# Altium project Smart wrist Band.PrjPcb
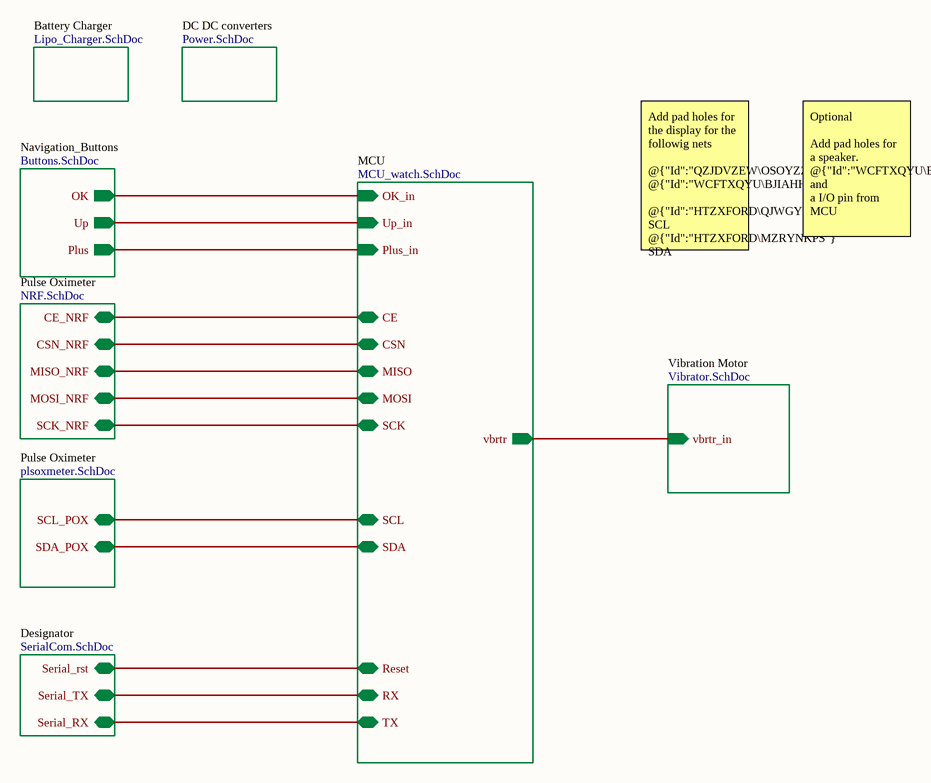
[diagram p0: Wrist watch main.SchDoc]
9 sheets, 85 parts. Net scope: hierarchical (ports join the sheet entries above them; power ports are global).
Board file: wrist_band_v1.0.PcbDoc
Sheets:
  Wrist watch main.SchDoc
    MCU = MCU_watch.SchDoc
    Pulse Oximeter = plsoxmeter.SchDoc
    Battery Charger = Lipo_Charger.SchDoc
    Vibration Motor = Vibrator.SchDoc
    Navigation_Buttons = Buttons.SchDoc
    DC DC converters = Power.SchDoc
    Pulse Oximeter = NRF.SchDoc
    Designator = SerialCom.SchDoc

## Sheet Wrist watch main.SchDoc: Wrist watch main
size A4; Subtitle: Subtitle; Project: Stearsafe; VersionRevision: VersionRevision; TotalSheet: TotalSheet; Author: Sajitha Madugalle; Revision: 1; SheetNumber: 1; SheetTotal: 9

### Sub-sheets
Battery Charger = Lipo_Charger.SchDoc: no entries
DC DC converters = Power.SchDoc: no entries
Designator = SerialCom.SchDoc: Serial_rst (bidir), Serial_TX (bidir), Serial_RX (bidir)
MCU = MCU_watch.SchDoc: SDA (bidir), SCL (bidir), OK_in (in), Up_in (in), Plus_in (in), vbrtr (out), CE (bidir), CSN (bidir), MISO (bidir), MOSI (bidir), SCK (bidir), Reset (bidir), RX (bidir), TX (bidir)
Navigation_Buttons = Buttons.SchDoc: OK (out), Up (out), Plus (out)
Pulse Oximeter = plsoxmeter.SchDoc: SCL_POX (bidir), SDA_POX (bidir)
Pulse Oximeter = NRF.SchDoc: CE_NRF (bidir), CSN_NRF (bidir), MISO_NRF (bidir), MOSI_NRF (bidir), SCK_NRF (bidir)
Vibration Motor = Vibrator.SchDoc: vbrtr_in (in)

### Nets
RST: sheet MCU/Reset, sheet Designator/Serial_rst
SW1: sheet MCU/Up_in, sheet Navigation_Buttons/Up
SW2: sheet MCU/OK_in, sheet Navigation_Buttons/OK
SW3: sheet MCU/Plus_in, sheet Navigation_Buttons/Plus
NetIC2_2: sheet MCU/SCL, sheet Pulse Oximeter/SCL_POX
NetIC2_3: sheet MCU/SDA, sheet Pulse Oximeter/SDA_POX
NetIC4_1: sheet MCU/CE, sheet Pulse Oximeter/CE_NRF
NetIC4_2: sheet MCU/CSN, sheet Pulse Oximeter/CSN_NRF
NetIC4_3: sheet MCU/SCK, sheet Pulse Oximeter/SCK_NRF
NetIC4_4: sheet MCU/MOSI, sheet Pulse Oximeter/MOSI_NRF
NetIC4_5: sheet MCU/MISO, sheet Pulse Oximeter/MISO_NRF
NetR10_1: sheet MCU/vbrtr, sheet Vibration Motor/vbrtr_in
NetR20_1: sheet MCU/TX, sheet Designator/Serial_RX
NetR21_1: sheet MCU/RX, sheet Designator/Serial_TX

### Notes on the sheet
- Add pad holes for the display for the followig nets
  @{"Id":"QZJDVZEW\OSOYZZOG"} @{"Id":"WCFTXQYU\BJIAHHOM"}
  @{"Id":"HTZXFORD\QJWGYBCR"} SCL
  @{"Id":"HTZXFORD\MZRYNKPS"} SDA
- Optional
  Add pad holes for a speaker. @{"Id":"WCFTXQYU\BJIAHHOM"} and
  a I/O pin from MCU
- Title:
- Size:
- Document Number :
- Revision
- Drawn by:
- Checked by:
- Date:
- A4
- Time:
- Aprooved by:
- Sheet:
- of
- File:

## Sheet MCU_watch.SchDoc: MCU_Watch
size A4; Author: Sajitha Madugalle; Revision: 1; SheetNumber: 5; SheetTotal: 8
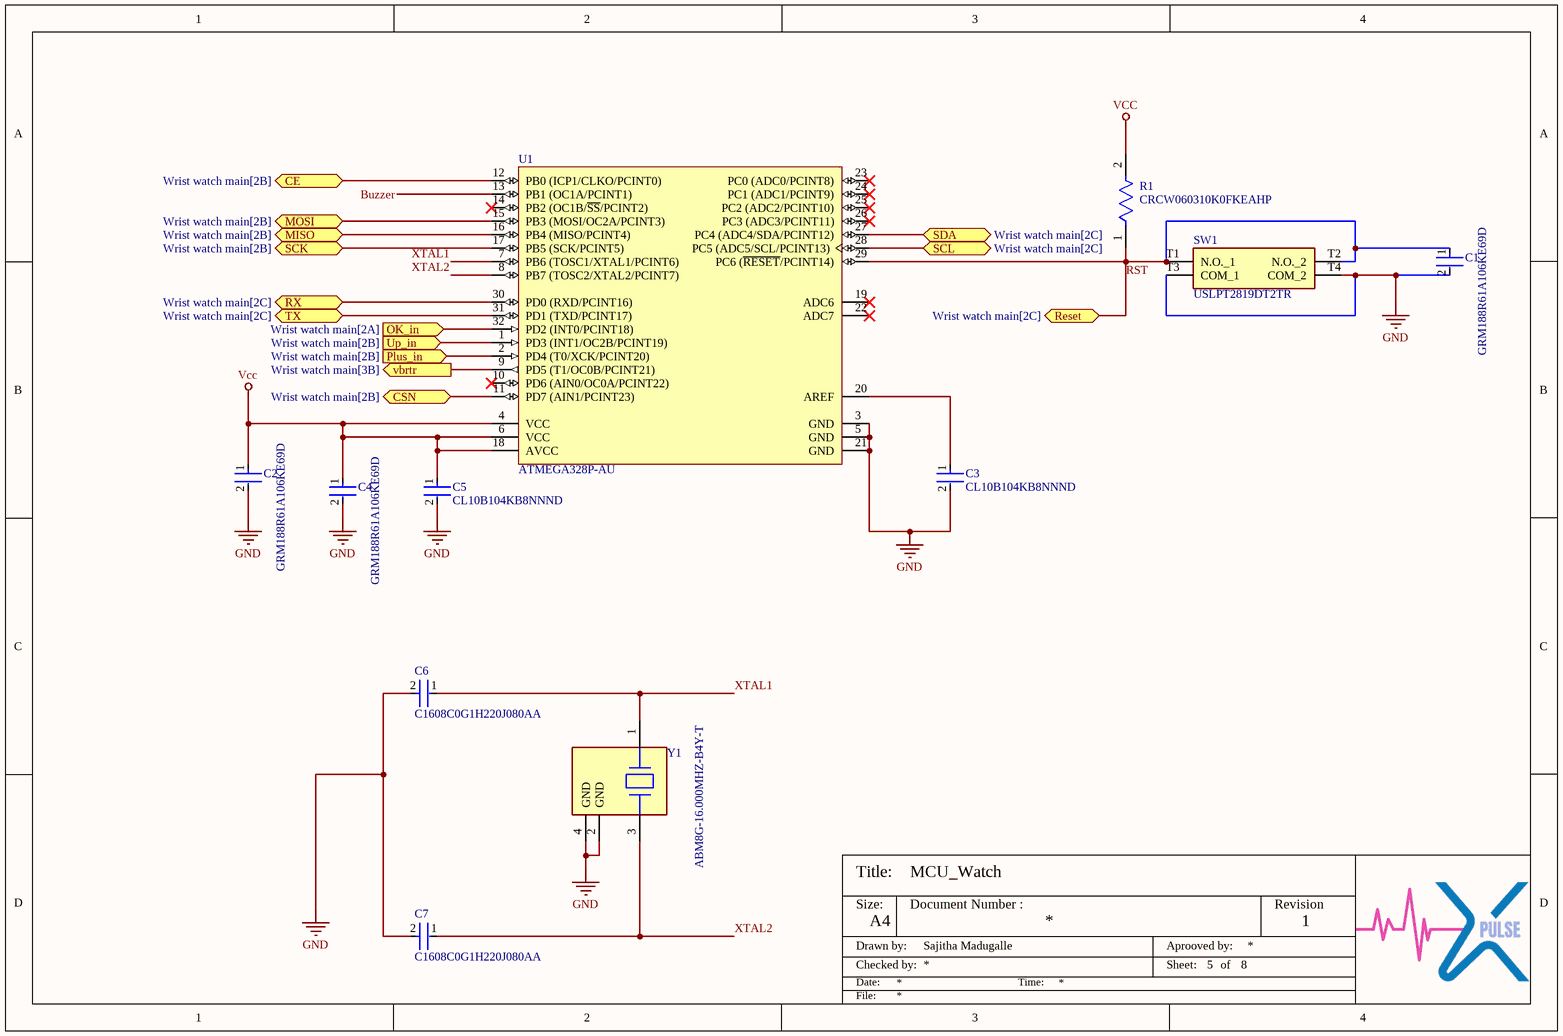
[diagram p1: MCU_watch.SchDoc]

### Parts
C1  GRM188R61A106KE69D  [FP-GRM18-0_15-MFG]
C2  GRM188R61A106KE69D  [FP-GRM18-0_15-MFG]
C3  CL10B104KB8NNND  [FP-CL10-IPC_A]
C4  GRM188R61A106KE69D  [FP-GRM18-0_15-MFG]
C5  CL10B104KB8NNND  [FP-CL10-IPC_A]
C6  C1608C0G1H220J080AA  [FP-C1608-080-0_1-IPC_B]
C7  C1608C0G1H220J080AA  [FP-C1608-080-0_1-IPC_B]
R1  CRCW060310K0FKEAHP  [FP-CRCW0603-HPe3-MFG]
SW1  USLPT2819DT2TR  [USLPT2819DT2TR]
U1  ATMEGA328P-AU  [ATML-32A_M]
Y1  ABM8G-16.000MHZ-B4Y-T  [FP-ABM8G-MFG]

### Ports
CE (bidir, see Wrist watch main[2B]), CSN (bidir, see Wrist watch main[2B]), MISO (bidir, see Wrist watch main[2B]), MOSI (bidir, see Wrist watch main[2B]), OK_in (in, see Wrist watch main[2A]), Plus_in (in, see Wrist watch main[2B]), Reset (bidir, see Wrist watch main[2C]), RX (bidir, see Wrist watch main[2C]), SCK (bidir, see Wrist watch main[2B]), SCL (bidir, see Wrist watch main[2C]), SDA (bidir, see Wrist watch main[2C]), TX (bidir, see Wrist watch main[2C]), Up_in (in, see Wrist watch main[2B]), vbrtr (out, see Wrist watch main[3B])

### Nets
GND: C1.2 C2.2 C3.2 C4.2 C5.2 C6.2 C7.2 SW1.T3(COM_1) SW1.T4(COM_2) U1.3(GND) U1.5(GND) U1.21(GND) Y1.2(GND) Y1.4(GND)
Vcc: C2.1 C4.1 C5.1 R1.2 U1.4(VCC) U1.6(VCC) U1.18(AVCC)
Buzzer: U1.13(PB1_(OC1A/PCINT1))
RST: C1.1 R1.1 SW1.T1(N.O._1) SW1.T2(N.O._2) U1.29(PC6_(~{RESET}/PCINT14)) ; port Reset
SW1: U1.1(PD3_(INT1/OC2B/PCINT19)) ; port Up_in
SW2: U1.32(PD2_(INT0/PCINT18)) ; port OK_in
SW3: U1.2(PD4_(T0/XCK/PCINT20)) ; port Plus_in
XTAL1: C6.1 U1.7(PB6_(TOSC1/XTAL1/PCINT6)) Y1.1
XTAL2: C7.1 U1.8(PB7_(TOSC2/XTAL2/PCINT7)) Y1.3
NetC3_1: C3.1 U1.20(AREF)
NetIC2_2: U1.28(PC5_(ADC5/SCL/PCINT13)) ; port SCL
NetIC2_3: U1.27(PC4_(ADC4/SDA/PCINT12)) ; port SDA
NetIC4_1: U1.12(PB0_(ICP1/CLKO/PCINT0)) ; port CE
NetIC4_2: U1.11(PD7_(AIN1/PCINT23)) ; port CSN
NetIC4_3: U1.17(PB5_(SCK/PCINT5)) ; port SCK
NetIC4_4: U1.15(PB3_(MOSI/OC2A/PCINT3)) ; port MOSI
NetIC4_5: U1.16(PB4_(MISO/PCINT4)) ; port MISO
NetR10_1: U1.9(PD5_(T1/OC0B/PCINT21)) ; port vbrtr
NetR20_1: U1.31(PD1_(TXD/PCINT17)) ; port TX
NetR21_1: U1.30(PD0_(RXD/PCINT16)) ; port RX

Not connected (* = marked no-connect by the designer): U1 10(PD6_(AIN0/OC0A/PCINT22))* 14(PB2_(OC1B/~{SS}/PCINT2))* 19(ADC6)* 22(ADC7)* 23(PC0_(ADC0/PCINT8))* 24(PC1_(ADC1/PCINT9))* 25(PC2_(ADC2/PCINT10))* 26(PC3_(ADC3/PCINT11))*

### Notes on the sheet
- Title:
- Size:
- Document Number :
- Revision
- Drawn by:
- Checked by:
- Date:
- A4
- Time:
- Aprooved by:
- Sheet:
- of
- File:

### Library data of the parts
C1 C2 C4 = CMP-2000-05448-2: CAP CER 10UF 10V X5R 0603; Manufacturer: Murata; Temperature Coefficient: 15%; Material: Ceramic; Tolerance: 10%; Device Class L1: Passive Components; ComponentLink2Description: Datasheet; Height: 0.95mm; Package: GRM18-0.15; Octopart: https://octopart.com/grm188r61a106ke69d-murata-22851381; Manufacturer Part Number: GRM188R61A106KE69D; Value: 10uF; Digikey Description: CAP CER 10UF 10V X5R 0603; Temperature Range High: +85°C; Temperature Range Low: -55°C; Temperature Characteristic: X5R; Capacitance: 10uF; RoHS: TRUE; Device Class L2: Capacitors; ComponentLink2URL: https://search.murata.co.jp/Ceramy/image/img/A01X/G101/ENG/GRM188R61A106KE69-01A.pdf; Device Class L3: Ceramic Capacitors; Lead Free: Yes; Mouser Description: Multilayer Ceramic Capacitors MLCC - SMD/SMT 0603 10uF 10volts X5R + - 10%; Category: Cap; Voltage Rating: 10V; Temperature: -55°C to +85°C; Automotive: No
C3 C5 = CMP-13271-000587-1: Cap Ceramic 100nF 50V X7R ±10% Pad SMD 0603 +125°C T/R; Case/Package: 0603; Depth: 0.8mm; Max Operating Temperature: 125°C; Lead Free: Lead Free; Material: Ceramic; Voltage Rating: 50V; Min Operating Temperature: -55°C; Voltage Rating (DC): 50V; Dielectric: X7R; Height: 0.8mm; Capacitance: 100nF; Thickness: 0.035inch; Radiation Hardening: No; Voltage: 50V; Packaging: Tape and Reel; Length: 1.6mm; Tolerance: 10%; Width: 0.031inch; Mount: Surface Mount; Package Quantity: 10000
C6 C7 = CMP-2000-06024-2: CAP CER 22PF 50V C0G 0603; Tolerance: 5%; Temperature Coefficient: 30ppm/°C; Dielectric Material: Ceramic; Packaging: Tape and Reel; Termination: SMD/SMT; Case Code (Imperial): 0603; Height: 0.8mm; Capacitance: 22pF; Voltage: 50V; RoHS Compliant: Yes; Voltage Rating: 50V; Depth: 0.8mm; Case Code (Metric): 1608; Voltage Rating (DC): 50V; Construction: Flat; Max Operating Temperature: 125°C; Radiation Hardening: No; Lead Free: Lead Free; Number of Pins: 2; Case/Package: 0603; Thickness: 0.037inch; Min Operating Temperature: -55°C; Width: 0.031inch; Mount: Surface Mount; Weight: 7.1E-05oz; Series: C; Dielectric: C0G; Package Quantity: 1; Length: 1.6mm
R1 = CMP-2000-03835-2: RES SMD 10K OHM 1% 1/3W 0603; Resistance: 10kR; Voltage Rating (DC): 75V; Max Power Dissipation: 250mW; Temperature Coefficient: 100ppm/°C; Case Code (Metric): 1608; Features: Automotive AEC-Q200; Termination: SMD/SMT; Number of Terminations: 2; Case Code (Imperial): 0603; Tolerance: 1%; Depth: 0.85mm; Package Quantity: 10; Length: 1.6mm; Packaging: Tape and Reel; Contact Plating: Tin; Radiation Hardening: No; Case/Package: 0603; Composition: Thick Film; Voltage Rating: 75V; Weight: 7.1E-05oz; Max Operating Temperature: 155°C; Lead Free: Lead Free; Width: 0.033inch; Power Rating: 250mW; Min Operating Temperature: -55°C; Military Standard: Not; Height: 0.45mm
SW1 = USLPT2819DT2TR: Switch; Manufacturer_Name: TE Connectivity; Datasheet Link: https://www.te.com/commerce/DocumentDelivery/DDEController?Action=srchrtrv&DocNm=2337225-1&DocType=Data%20Sheet&DocLang=English&PartCntxt=2337225-1&DocFormat=pdf; Height: 0.6mm; Manufacturer_Part_Number: USLPT2819DT2TR; Mouser Part Number: 506-USLPT2819DT2TR; Mouser Price/Stock: https://www.mouser.co.uk/ProductDetail/TE-Connectivity-PB/USLPT2819DT2TR?qs=qSfuJ%252Bfl%2Fd7zUoyEnK5Yzg%3D%3D; Arrow Part Number: USLPT2819DT2TR; Arrow Price/Stock: https://www.arrow.com/en/products/uslpt2819dt2tr/te-connectivity?region=nac
U1 = CMP-020-00003-3: 8-Bit Microcontroller with 32 KBytes In-System Programmable Flash, 23 I/Os, -40 to 85 degC, 32-Pin TQFP (32A), RoHS, Tray; Manufacturer: Atmel; PWM Channels: 6; Frequency: 20MHz; RAM Size: 2KB; ADC Channels: 8; Max Supply Voltage: 5.5V; Density: 32KB; USB Channels: 0; I/Os: 23; Min Supply Voltage: 1.8V; Interface: USART; Package Reference: 32A; Package Description: 32-Pin Thin Profile Plastic Quad Flat Package, Body 7 x 7 mm, Pitch 0.8 mm; Max Operating Temperature: 85°C; Mounting Technology: SM; Datasheet URL: http://www.atmel.com/images/Atmel-8271-8-bit-AVR-Microcontroller-ATmega48A-48PA-88A-88PA-168A-168PA-328-328P_datasheet_Complete.pdf; Pins: 32; Packaging: Tray; RoHS Compliant: True; Max Clock Frequency: 20MHz; Ethernet Channels: 0; Clock Frequency: 20MHz; Case/Package: TQFP; Manufacturer URL: http://www.atmel.com/; Datasheet Version: Rev. 8271J, 11/2015; Package Quantity: 250; Min Operating Temperature: -40°C
Y1 = CMP-27762-015167-1: Crystal 16MHz ±30ppm (Tol) ±30ppm (Stability) 10pF FUND 80Ω 4-Pin SMD T/R; ESR (Equivalent Series Resistance): 80R; Package Quantity: 1000; Frequency: 16MHz; Length: 3.2mm; Tolerance: 30ppm; Frequency Stability: 30ppm; Depth: 2.5mm; Termination: SMD/SMT; Number of Pins: 4; Max Operating Temperature: 70°C; Min Operating Temperature: -20°C; Mount: Surface Mount; Lead Free: Lead Free; Frequency Tolerance: 30ppm; Width: 2.5mm; Series: ABM8G; Load Capacitance: 10pF; Operating Frequency: 16 MHz; Case/Package: CSMD; Height: 1mm; Packaging: Tape and Reel

## Sheet plsoxmeter.SchDoc: Pulse oximeter
size A4; Revision: 1; SheetNumber: 5; SheetTotal: 9
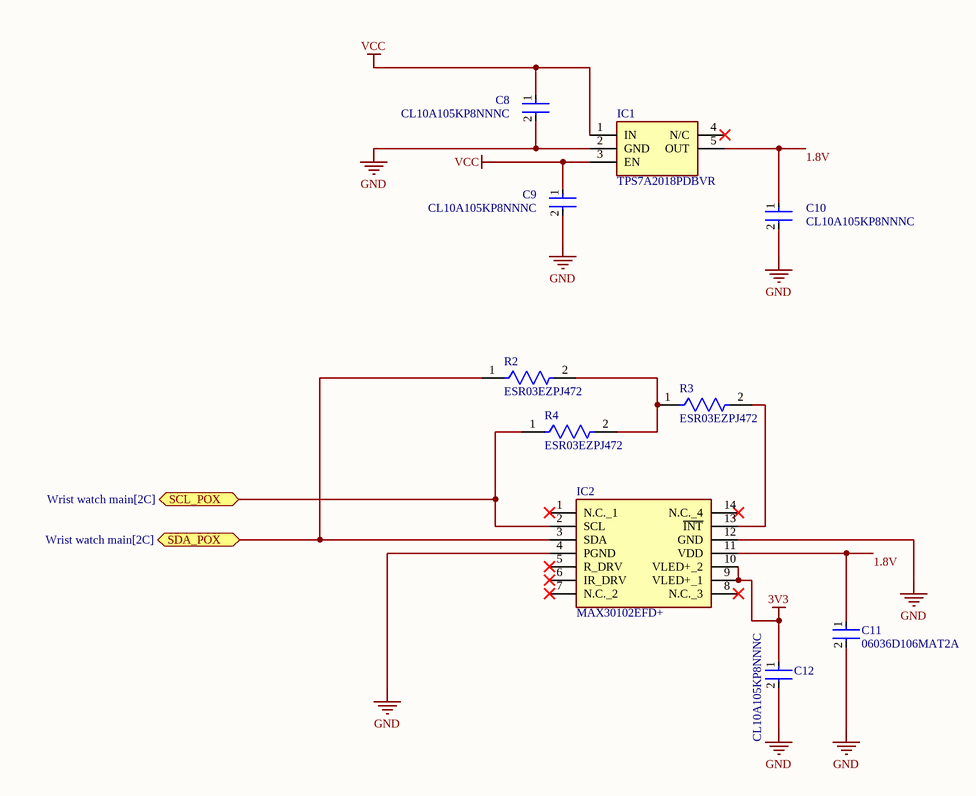
[diagram p2: plsoxmeter.SchDoc]

### Parts
C8  CL10A105KP8NNNC  [FP-CL10-IPC_C]
C9  CL10A105KP8NNNC  [FP-CL10-IPC_C]
C10  CL10A105KP8NNNC  [FP-CL10-IPC_C]
C11  06036D106MAT2A  [FP-0603-L_1_6_0_15-W_0_81-IPC_B]
C12  CL10A105KP8NNNC  [FP-CL10-IPC_C]
IC1  TPS7A2018PDBVR  [SOT95P280X145-5N]
IC2  MAX30102EFD+  [14-LEAD-OESIP]
R2  ESR03EZPJ472  [FP-ESR03-IPC_A]
R3  ESR03EZPJ472  [FP-ESR03-IPC_A]
R4  ESR03EZPJ472  [FP-ESR03-IPC_A]

### Ports
SCL_POX (bidir, see Wrist watch main[2C]), SDA_POX (bidir, see Wrist watch main[2C])

### Nets
3V3: C12.1 IC2.9(VLED+_1) IC2.10(VLED+_2)
GND: C8.2 C9.2 C10.2 C11.2 C12.2 IC1.2(GND) IC2.4(PGND) IC2.12(GND)
Vcc: C8.1 C9.1 IC1.1(IN) IC1.3(EN)
1.8V: C10.1 C11.1 IC1.5(OUT) IC2.11(VDD)
NetIC2_2: IC2.2(SCL) R4.1 ; port SCL_POX
NetIC2_3: IC2.3(SDA) R2.1 ; port SDA_POX
NetIC2_13: IC2.13(~{INT}) R3.2
NetR2_2: R2.2 R3.1 R4.2

Not connected (* = marked no-connect by the designer): IC1 4(N/C)*; IC2 1(N.C._1)* 5(R_DRV)* 6(IR_DRV)* 7(N.C._2)* 8(N.C._3)* 14(N.C._4)*

### Notes on the sheet
- Title:
- Size:
- Document Number :
- Revision
- Drawn by:
- Checked by:
- Date:
- A4
- Time:
- Aprooved by:
- Sheet:
- of
- File:
- URL:

### Library data of the parts
C8-C10 C12 = CMP-13271-003399-1: Cap Ceramic 1uF 10V X5R ±10% Pad SMD 0603 +85°C T/R; Min Operating Temperature: -55°C; Max Operating Temperature: 85°C; Dielectric: X5R; Contact Plating: Tin; Height: 0.8mm; Voltage: 10V; Packaging: Tape and Reel; Voltage Rating: 10V; Capacitance: 1uF; Package Quantity: 1; Width: 0.031inch; Length: 1.6mm; Depth: 0.8mm; Case/Package: 0603; Case Code (Imperial): 0603; Thickness: 0.035inch; Radiation Hardening: No; Tolerance: 10%; Case Code (Metric): 1608; Mount: Surface Mount
C11 = CMP-2006-04476-2: General Purpose Ceramic Capacitor, 0603, 10uF, 20%, X5R, 15%, 6.3V; RoHS Compliant: Yes; Case Code (Imperial): 0603; Construction: Flat; Thickness: 0.035inch; Height: 0.9mm; Number of Pins: 2; Max Operating Temperature: 85°C; Capacitance: 10uF; Length: 1.6mm; REACH SVHC: No SVHC; Width: 0.032inch; Voltage Rating (DC): 6.3V; Termination: SMD/SMT; Contact Plating: Tin; Min Operating Temperature: -55°C; Depth: 0.81mm; Packaging: Tape and Reel; Case Code (Metric): 1608; Voltage Rating: 6.3V; Lead Free: Lead Free; Mount: Surface Mount; Radiation Hardening: No; Series: -; Dielectric Material: Ceramic; Package Quantity: 1; Case/Package: 0603; Tolerance: 20%; Dielectric: X5R; Voltage: 6.3V
IC1 = TPS7A2018PDBVR: Integrated Circuit; Manufacturer_Name: Texas Instruments; Datasheet Link: https://datasheet.datasheetarchive.com/originals/distributors/Datasheets_SAMA/e65d9d311cedf91014769949f3101225.pdf; Height: 1.45mm; Manufacturer_Part_Number: TPS7A2018PDBVR; Mouser Part Number: 595-TPS7A2018PDBVR; Mouser Price/Stock: https://www.mouser.co.uk/ProductDetail/Texas-Instruments/TPS7A2018PDBVR?qs=hd1VzrDQEGheW9qdrIVGew%3D%3D; Arrow Part Number: TPS7A2018PDBVR; Arrow Price/Stock: https://www.arrow.com/en/products/tps7a2018pdbvr/texas-instruments?region=nac
IC2 = MAX30102EFD+: Integrated Circuit; Manufacturer_Name: Analog Devices; Datasheet Link: https://datasheets.maximintegrated.com/en/ds/MAX30102.pdf; Manufacturer_Part_Number: MAX30102EFD+; Mouser Part Number: 700-MAX30102EFD+; Mouser Price/Stock: https://www.mouser.co.uk/ProductDetail/Analog-Devices-Maxim-Integrated/MAX30102EFD%2b?qs=nVS1qgv%252BQrk9UYEvS27V%2Fg%3D%3D
R2-R4 = CMP-08839-007853-1: 4.7kΩ ±5% 0.25W 0603 Anti-Surge Chip Resistor AEC-Q200; Max Power Dissipation: 250mW; Resistance: 4.7kR; Temperature Coefficient: 200ppm/°C; Packaging: Tape and Reel; Series: ESR; Height: 0.022inch; Case Code (Imperial): 0603; Tolerance: 5%; RoHS Compliant: Yes; Case/Package: 0603; Min Operating Temperature: -55°C; Resistor Type: Thick Film; Package Quantity: 5000; Features: Automotive AEC-Q200; Width: 0.031inch; Length: 0.063inch; Max Operating Temperature: 155°C; Number of Terminations: 2

## Sheet Lipo_Charger.SchDoc: USB_Charger
size A4; Author: Sajitha Madugalle; Revision: 1; SheetNumber: 3; SheetTotal: 9
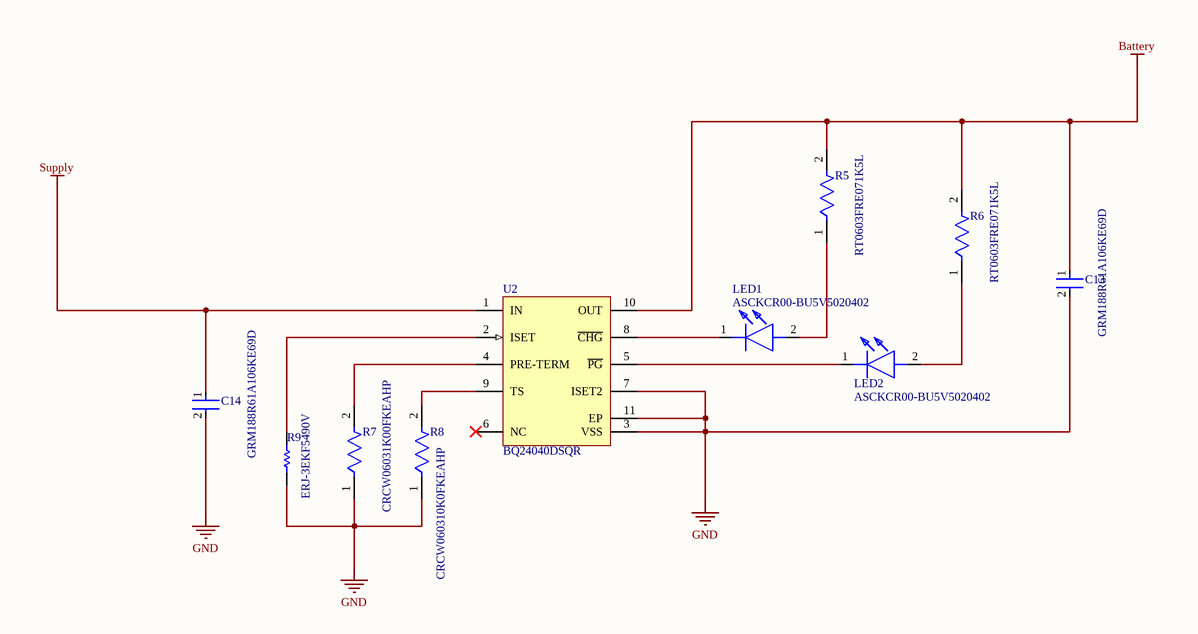
[diagram p3: Lipo_Charger.SchDoc]

### Parts
C13  GRM188R61A106KE69D  [FP-GRM18-0_15-MFG]
C14  GRM188R61A106KE69D  [FP-GRM18-0_15-MFG]
LED1  ASCKCR00-BU5V5020402  [ASCKCR00BU5V5020402]
LED2  ASCKCR00-BU5V5020402  [ASCKCR00BU5V5020402]
R5  RT0603FRE071K5L  [FP-RT0603-MFG]
R6  RT0603FRE071K5L  [FP-RT0603-MFG]
R7  CRCW06031K00FKEAHP  [FP-CRCW0603-HPe3-MFG]
R8  CRCW060310K0FKEAHP  [FP-CRCW0603-HPe3-MFG]
R9  ERJ-3EKF5490V  [RESC1608X55X30ML15T15]
U2  BQ24040DSQR  [DSQ0010A_V]

### Nets
Battery: C13.1 R5.2 R6.2 U2.10(OUT)
GND: C13.2 C14.2 R7.1 R8.1 R9.1 U2.3(VSS) U2.7(ISET2) U2.11(EP)
Supply: C14.1 U2.1(IN)
NetLED1_1: LED1.1(K) U2.8(~{CHG})
NetLED1_2: LED1.2(A) R5.1
NetLED2_1: LED2.1(K) U2.5(~{PG})
NetLED2_2: LED2.2(A) R6.1
NetR7_2: R7.2 U2.4(PRE-TERM)
NetR8_2: R8.2 U2.9(TS)
NetR9_2: R9.2 U2.2(ISET)

Not connected (* = marked no-connect by the designer): U2 6(NC)*

### Notes on the sheet
- Title:
- Size:
- Document Number :
- Revision
- Drawn by:
- Checked by:
- Date:
- A4
- Time:
- Aprooved by:
- Sheet:
- of
- File:

### Library data of the parts
C13 C14 = CMP-2000-05448-2: as C1 on sheet MCU_watch; Device Class L1: Passive Components; ComponentLink2Description: Datasheet; Height: 0.95mm; Package: GRM18-0.15; Octopart: https://octopart.com/grm188r61a106ke69d-murata-22851381; Manufacturer Part Number: GRM188R61A106KE69D; Value: 10uF; Digikey Description: CAP CER 10UF 10V X5R 0603; Temperature Range High: +85°C; Temperature Range Low: -55°C; Temperature Characteristic: X5R; Capacitance: 10uF; RoHS: TRUE; Device Class L2: Capacitors; ComponentLink2URL: https://search.murata.co.jp/Ceramy/image/img/A01X/G101/ENG/GRM188R61A106KE69-01A.pdf; Device Class L3: Ceramic Capacitors; Lead Free: Yes; Mouser Description: Multilayer Ceramic Capacitors MLCC - SMD/SMT 0603 10uF 10volts X5R + - 10%; Category: Cap; Voltage Rating: 10V; Temperature: -55°C to +85°C; Automotive: No
LED1 LED2 = ASCKCR00-BU5V5020402: LED; Manufacturer_Name: Avago Technologies; Datasheet Link: https://docs.broadcom.com/doc/ASCKCx00-xxxxx0x0x02-DS; Height: 0.75mm; Manufacturer_Part_Number: ASCKCR00-BU5V5020402; Mouser Part Number: 630-ASCKCR00BU5V5020; Mouser Price/Stock: https://www.mouser.co.uk/ProductDetail/Broadcom-Avago/ASCKCR00-BU5V5020402?qs=OcgtsXO%252B3gu355%2FiA8jcWA%3D%3D
R5 R6 = CMP-03412-003799-1: RES SMD 1.5K OHM 1% 1/10W 0603; Manufacturer: Yageo; Value: 1.5KΩ; Temperature Coefficient: 50 ppm/°C; Voltage Rating: 75V; Power Rating: 0.1W; Tolerance: 0.01; Lead Free: Yes; Composition: Thin Film; ComponentLink2Description: Datasheet; Device Class L3: Chip SMD Resistors; Octopart: https://octopart.com/rt0603fre071k5l-yageo-39862564; Device Class L1: Passive Components; Category: Res; Ipc Land Pattern Name: RESC16080X45; Automotive: No; Manufacturer Part Number: RT0603FRE071K5L; Resistance: 1.5KΩ; Temperature Range High: +155°C; Package: RT0603; Footprint Url: http://www.yageo.com/exep/pages/download/literatures/PYu-R_Mount_10.pdf; Series: RT; RoHS: TRUE; Mouser Description: Thin Film Resistors - SMD 1/10W 1.5K ohm 1% 50ppm; Temperature: -55°C to +155°C; ComponentLink2URL: http://www.yageo.com/documents/recent/PYu-RT_1-to-0.01_RoHS_L_9.pdf; Temperature Range Low: -55°C; Device Class L2: Resistors; Digikey Description: RES SMD 1.5K OHM 1% 1/10W 0603; Height: 0.55mm
R7 = CMP-2000-02970-2: RES Thick Film, 1kΩ, 1%, 0.33W, 100ppm/°C, 0603; Max Power Dissipation: 250mW; Voltage Rating (DC): 75V; Resistance: 1kR; Number of Terminations: 2; Min Operating Temperature: -55°C; Contact Plating: Tin; Termination: SMD/SMT; Weight: 7.1E-05oz; Height: 0.45mm; Radiation Hardening: No; Package Quantity: 10; Case Code (Imperial): 0603; Packaging: Tape and Reel; Max Operating Temperature: 155°C; Case/Package: 0603; Lead Free: Lead Free; Military Standard: Not; Mount: Surface Mount; Power Rating: 250mW; Length: 1.6mm; Features: Automotive AEC-Q200; Number of Pins: 2; Voltage Rating: 75V; Temperature Coefficient: 100ppm/°C; Depth: 0.85mm; Tolerance: 1%; Composition: Thick Film; Width: 0.8mm; Case Code (Metric): 1608
R8 = CMP-2000-03835-2: as R1 on sheet MCU_watch; Case Code (Metric): 1608; Features: Automotive AEC-Q200; Termination: SMD/SMT; Number of Terminations: 2; Case Code (Imperial): 0603; Tolerance: 1%; Depth: 0.85mm; Package Quantity: 10; Length: 1.6mm; Packaging: Tape and Reel; Contact Plating: Tin; Radiation Hardening: No; Case/Package: 0603; Composition: Thick Film; Voltage Rating: 75V; Weight: 7.1E-05oz; Max Operating Temperature: 155°C; Lead Free: Lead Free; Width: 0.033inch; Power Rating: 250mW; Min Operating Temperature: -55°C; Military Standard: Not; Height: 0.45mm
R9 = CMP-2000-00559-1: Manufacturer: Panasonic; Part Number: ERJ-3EKF5490V
U2 = CMP-0321-00456-2: 800 mA, Single-Input, Single Cell Li-Ion Battery Charger with Auto Start. Vovp=6.6 V, 3.5 V, -40 to 85 degC, 10-pin SON (DSQ), Green (RoHS & no Sb/Br); Manufacturer: Texas Instruments; NiCd: N; Vin(Min)(V): 3.5; SubFamily: Battery Charge Management; PackageDescription: 10-Pin Plastic Small Outline No-Lead, 2 x 2 x 0.8 mm Body, 0.4 mm Pitch, Exposed Pad; PackageVersion: revB, Apr-2010; Mounting Technology: Surface Mount; Eco-Plan: Green (RoHS & no Sb/Br); ComponentLink1URL: http://www.ti.com/general/docs/lit/getliterature.tsp?genericPartNumber=BQ24040&fileType=pdf; PartNumber: BQ24040DSQR; DatasheetVersion: SLUS941A; Over Voltage Protection: N; PackageReference: DSQ0010A; NiMH: N; Li-Ion: N; Lead Acid: N; Li-Polymer: N; ComponentLink1Description: Datasheet

## Sheet Vibrator.SchDoc: Vibration motor
size A4; Author: Sajitha Madugalle; Revision: 1; SheetNumber: 6; SheetTotal: 9
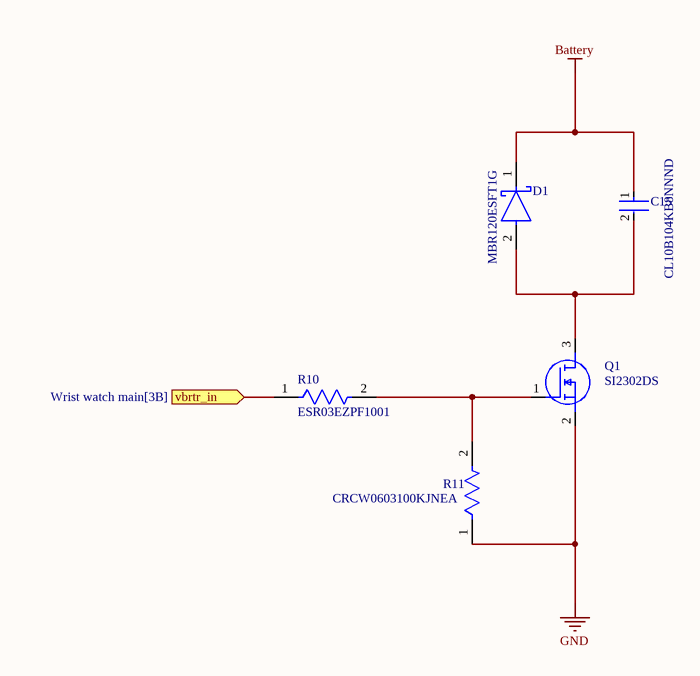
[diagram p4: Vibrator.SchDoc]

### Parts
C15  CL10B104KB8NNND  [FP-CL10-IPC_A]
D1  MBR120ESFT1G  [On_Semiconductor_498_MFG]
Q1  SI2302DS  [SOT95P230X110-3N]
R10  ESR03EZPF1001  [FP-ESR03-IPC_A]
R11  CRCW0603100KJNEA  [FP-CRCW0603-e3-IPC_C]

### Ports
vbrtr_in (in, see Wrist watch main[3B])

### Nets
Battery: C15.1 D1.1(C)
GND: Q1.2(S) R11.1
NetC15_2: C15.2 D1.2(A) Q1.3(D)
NetQ1_1: Q1.1(G) R10.2 R11.2
NetR10_1: R10.1 ; port vbrtr_in

### Notes on the sheet
- Title:
- Size:
- Document Number :
- Revision
- Drawn by:
- Checked by:
- Date:
- A4
- Time:
- Aprooved by:
- Sheet:
- of
- File:

### Library data of the parts
C15 = CMP-13271-000587-1: as C3 on sheet MCU_watch; Case/Package: 0603; Depth: 0.8mm; Max Operating Temperature: 125°C; Lead Free: Lead Free; Material: Ceramic; Voltage Rating: 50V; Min Operating Temperature: -55°C; Voltage Rating (DC): 50V; Dielectric: X7R; Height: 0.8mm; Capacitance: 100nF; Thickness: 0.035inch; Radiation Hardening: No; Voltage: 50V; Packaging: Tape and Reel; Length: 1.6mm; Tolerance: 10%; Width: 0.031inch; Mount: Surface Mount; Package Quantity: 10000
D1 = CMP-1055-00434-2: NexarPartId: 330787; Manufacturer Lifecycle Status: ACTIVE; Voltage Rating (DC): 20V; Max Forward Surge Current (Ifsm): 40A; Output Current: 1A; Max Junction Temperature (Tj): 150°C; Polarity: Standard; Peak Reverse Current: 10µA; Element Configuration: Single; Forward Voltage: 530mV; Lifecycle Status: Production; Packaging: Cut Tape; Lead Free: Lead Free; Radiation Hardening: No; Min Operating Temperature: -65°C; Average Rectified Current: 1A; Current Rating: 1A; Max Reverse Voltage (DC): 20V; RoHS: Compliant; REACH SVHC: No SVHC; Max Surge Current: 40A; Length: 2.9mm; Forward Current: 1A; Height: 880µm; Contact Plating: Tin; Width: 1.8mm; Reverse Voltage: 20V; Schedule B: 8541100080; Peak Non-Repetitive Surge Current: 40A; Max Operating Temperature: 150°C; Max Repetitive Reverse Voltage (Vrrm): 20V; Max Reverse Leakage Current: 10µA; Number of Pins: 2; Halogen Free: Halogen Free
Q1 = SI2302DS: MOSFET (N-Channel); Manufacturer_Name: Nexperia; Datasheet Link: https://assets.nexperia.com/documents/data-sheet/SI2302DS.pdf; Height: 1.1mm; Manufacturer_Part_Number: SI2302DS; Mouser Part Number: N/A; Mouser Price/Stock: https://www.mouser.com/Search/Refine.aspx?Keyword=N%2FA
R10 = CMP-08839-029483-1: 1kΩ ±1% 0.25W 0603 Anti-Surge Chip Resistor AEC-Q200; Power Rating: 250mW; Resistance: 1kR; Temperature Coefficient: 100ppm/°C; Series: ESR; Max Operating Temperature: 155°C; Case Code (Metric): 1608; Package Quantity: 1; Case/Package: 0603; Size Code: 0603; Case Code (Imperial): 0603; Min Operating Temperature: -55°C; Tolerance: 1%; Max Power Dissipation: 250mW; Number of Terminations: 2; RoHS Compliant: Yes; Lead Free: Lead Free; Packaging: Tape and Reel; Height: 0.022inch; Width: 0.031inch; Features: Automotive AEC-Q200; Resistor Type: Thick Film; Length: 0.063inch
R11 = CMP-2000-03823-2: RES Thick Film, 100kΩ, 5%, 0.1W, 200ppm/°C, 0603; Power Rating: 100mW; Voltage Rating: 75V; Resistance: 100kR; Radiation Hardening: No; Min Operating Temperature: -55°C; Width: 0.85mm; Case Code (Metric): 1608; Max Power Dissipation: 100mW; Composition: Thick Film; Temperature Coefficient: 200ppm/°C; Tolerance: 5%; Termination: SMD/SMT; Military Standard: Not; Weight: 7.1E-05oz; Number of Pins: 2; Mount: Surface Mount; Depth: 0.85mm; Max Operating Temperature: 155°C; Case/Package: 0603; Working Voltage: 75V; Number of Terminations: 2; Package Quantity: 1; Case Code (Imperial): 0603; Contact Plating: Tin; Length: 1.55mm; Packaging: Tape and Reel; Height: 0.02inch; Features: Automotive AEC-Q200

## Sheet Buttons.SchDoc
size A4; Subtitle: Subtitle; Project: Project; VersionRevision: VersionRevision; TotalSheet: TotalSheet; SheetNumber: 7; SheetTotal: 9
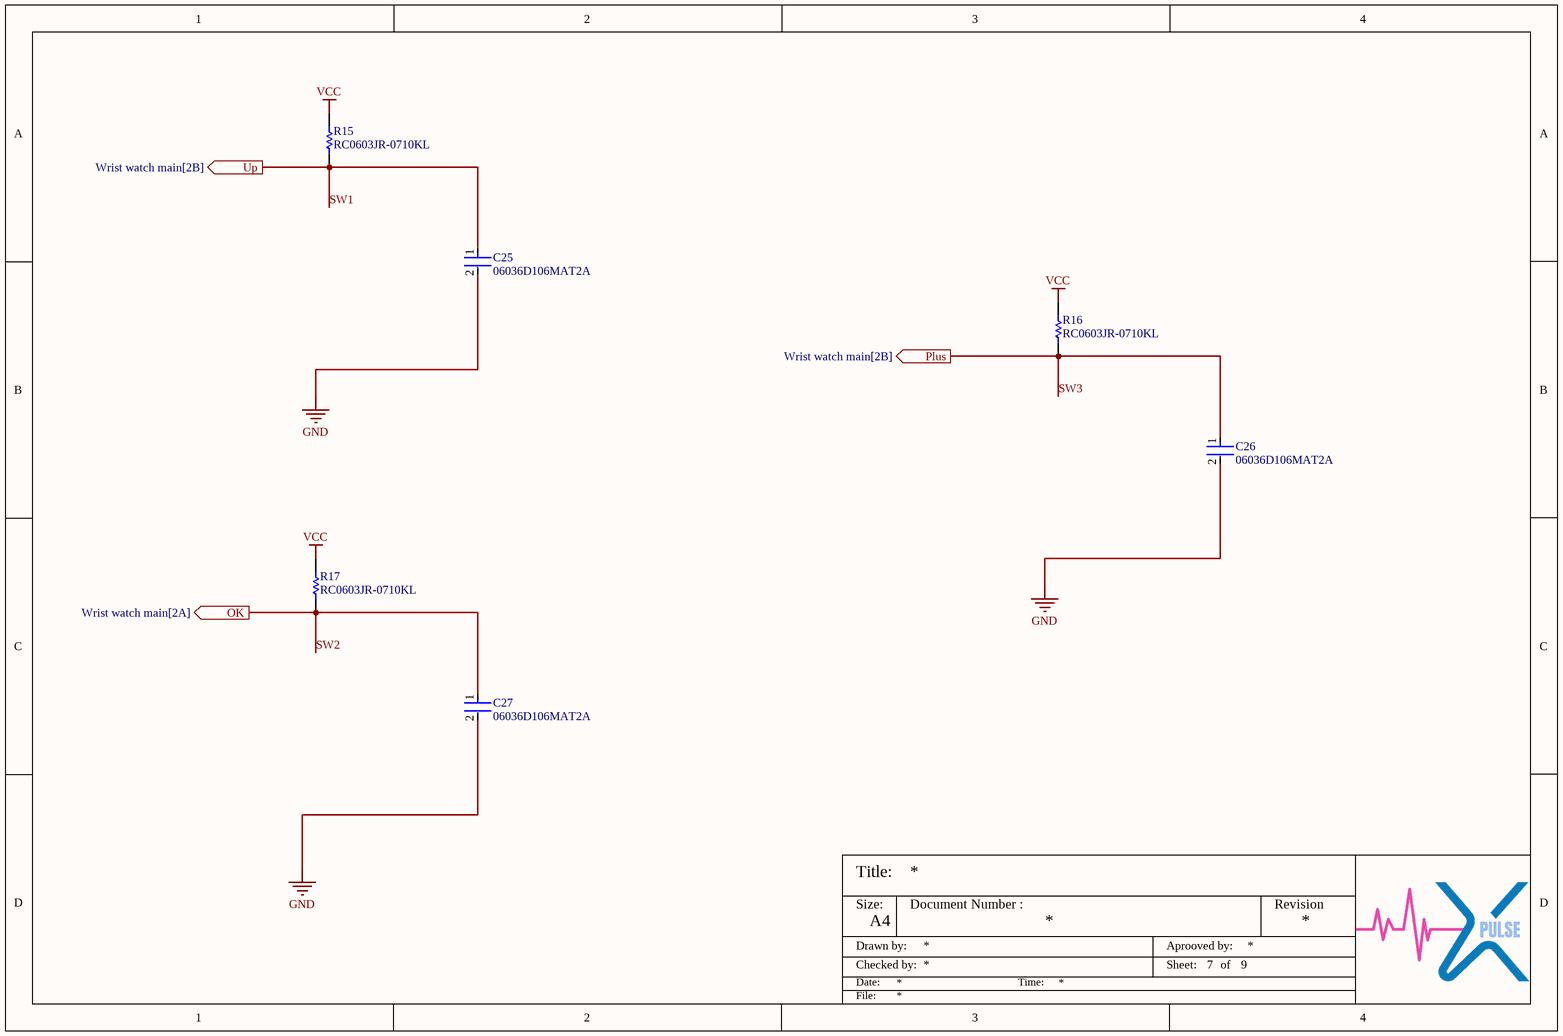
[diagram p5: Buttons.SchDoc]

### Parts
C25  06036D106MAT2A  [FP-0603-L_1_6_0_15-W_0_81-IPC_B]
C26  06036D106MAT2A  [FP-0603-L_1_6_0_15-W_0_81-IPC_B]
C27  06036D106MAT2A  [FP-0603-L_1_6_0_15-W_0_81-IPC_B]
R15  RC0603JR-0710KL  [RESC1608X55X25ML10T15]
R16  RC0603JR-0710KL  [RESC1608X55X25ML10T15]
R17  RC0603JR-0710KL  [RESC1608X55X25ML10T15]

### Ports
OK (out, see Wrist watch main[2A]), Plus (out, see Wrist watch main[2B]), Up (out, see Wrist watch main[2B])

### Nets
GND: C25.2 C26.2 C27.2
Vcc: R15.2 R16.2 R17.2
SW1: C25.1 R15.1 ; port Up
SW2: C27.1 R17.1 ; port OK
SW3: C26.1 R16.1 ; port Plus

### Notes on the sheet
- Title:
- Size:
- Document Number :
- Revision
- Drawn by:
- Checked by:
- Date:
- A4
- Time:
- Aprooved by:
- Sheet:
- of
- File:

### Library data of the parts
C25-C27 = CMP-2006-04476-2: as C11 on sheet plsoxmeter; RoHS Compliant: Yes; Case Code (Imperial): 0603; Construction: Flat; Thickness: 0.035inch; Height: 0.9mm; Number of Pins: 2; Max Operating Temperature: 85°C; Capacitance: 10uF; Length: 1.6mm; REACH SVHC: No SVHC; Width: 0.032inch; Voltage Rating (DC): 6.3V; Termination: SMD/SMT; Contact Plating: Tin; Min Operating Temperature: -55°C; Depth: 0.81mm; Packaging: Tape and Reel; Case Code (Metric): 1608; Voltage Rating: 6.3V; Lead Free: Lead Free; Mount: Surface Mount; Radiation Hardening: No; Series: -; Dielectric Material: Ceramic; Package Quantity: 1; Case/Package: 0603; Tolerance: 20%; Dielectric: X5R; Voltage: 6.3V
R15-R17 = CMP-2000-05022-1: Resistor, 10 KOhm, +/- 5%, 100 mW, -55 to 155 degC, 0603 (1608 Metric), RoHS, Tape and Reel; Manufacturer: Yageo; Resistance: 10kOhms; Voltage Rating: 50V; Temperature Coefficient: 100PPM/C; Power Rating: 100mW; Package Reference: 603; Series: RC; Case Code - mm: 1608; Packaging: Reel; Datasheet URL: http://www.farnell.com/datasheets/443971.pdf; Datasheet Version: Rev. 4, 04/2009; Operating Temperature Range: -55Cto+155C; Product: ThickFilmResistorsGeneralPurpose; Package Description: 2-Pin Surface Mount Device, Body 1.6 x 0.8 mm; Manufacturer URL: http://www.yageo.com/; Case Code - in: 0603; Tolerance: 5%; Termination Style: SMD/SMT

## Sheet Power.SchDoc: DC DC converter
size A4; Author: Sajitha Madugalle; Revision: 1; SheetNumber: 4; SheetTotal: 9
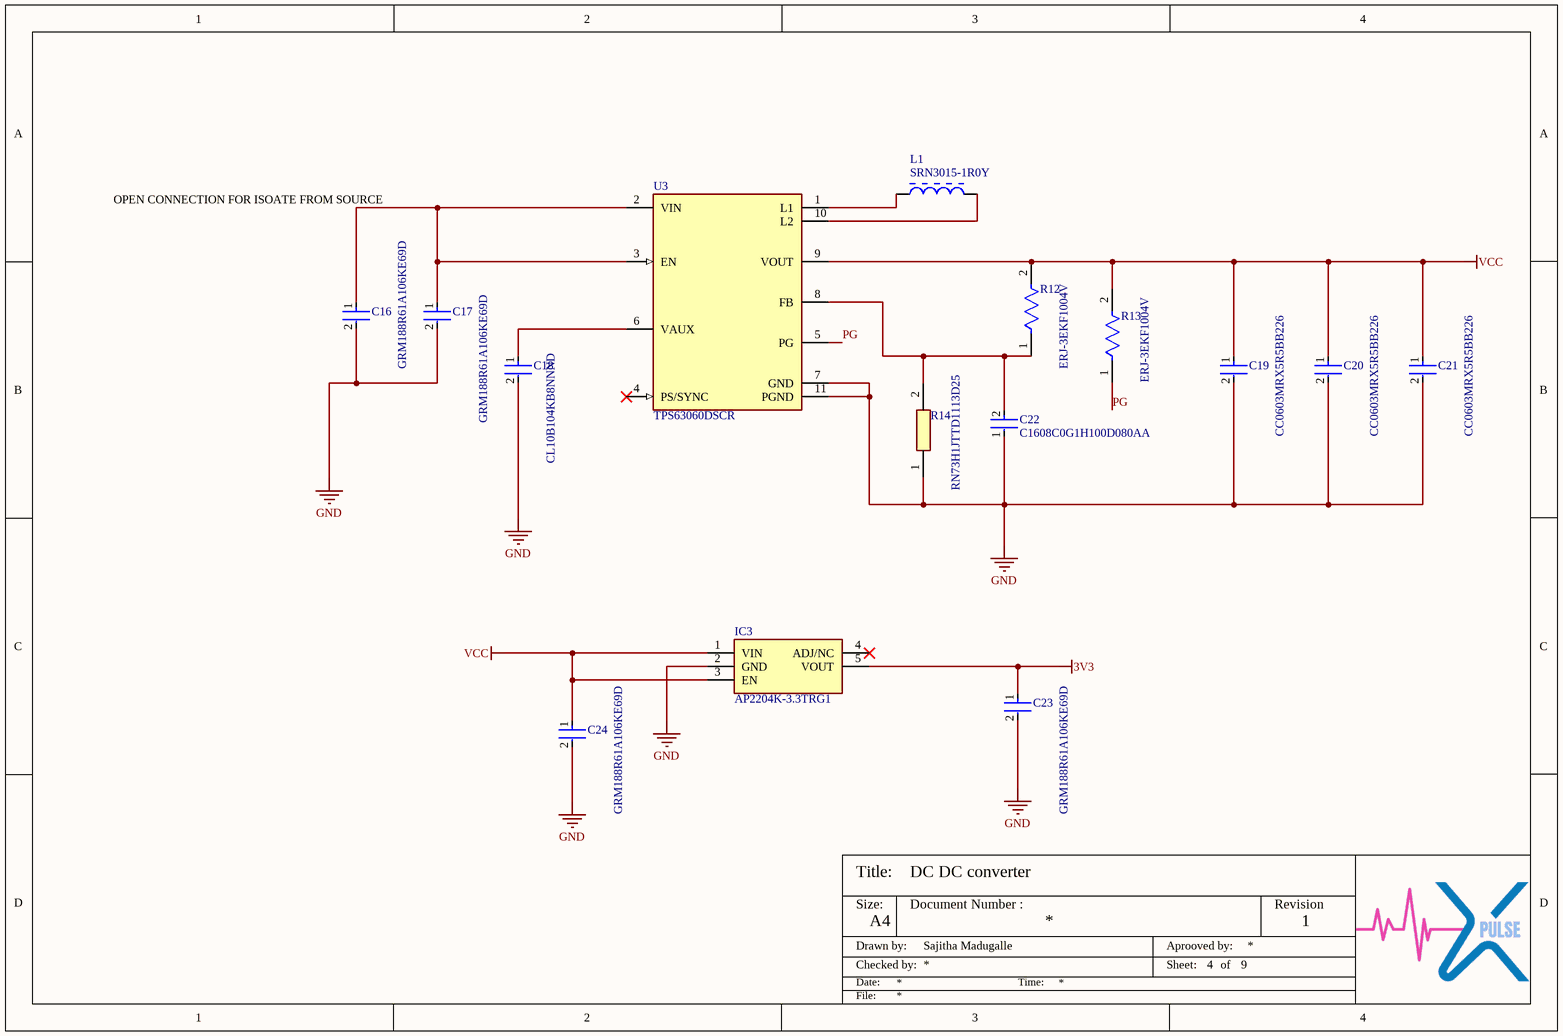
[diagram p6: Power.SchDoc]

### Parts
C16  GRM188R61A106KE69D  [FP-GRM18-0_15-MFG]
C17  GRM188R61A106KE69D  [FP-GRM18-0_15-MFG]
C18  CL10B104KB8NNND  [FP-CL10-IPC_A]
C19  CC0603MRX5R5BB226  [FP-CC0603-DC-MFG]
C20  CC0603MRX5R5BB226  [FP-CC0603-DC-MFG]
C21  CC0603MRX5R5BB226  [FP-CC0603-DC-MFG]
C22  C1608C0G1H100D080AA  [FP-C1608-080-0_1-IPC_C]
C23  GRM188R61A106KE69D  [FP-GRM18-0_15-MFG]
C24  GRM188R61A106KE69D  [FP-GRM18-0_15-MFG]
IC3  AP2204K-3.3TRG1  [SOT95P282X145-5N]
L1  SRN3015-1R0Y  [BOUR-SRN3015-2_V]
R12  ERJ-3EKF1004V  [FP-ERJ3EK-IPC_C]
R13  ERJ-3EKF1004V  [FP-ERJ3EK-IPC_C]
R14  RN73H1JTTD1113D25  [RESC1608X55N]
U3  TPS63060DSCR  [FP-DSC0010G-MFG]

### Nets
3V3: C23.1 IC3.5(VOUT)
GND: C16.2 C17.2 C18.2 C19.2 C20.2 C21.2 C22.1 C23.2 C24.2 IC3.2(GND) R14.1 U3.7(GND) U3.11(PGND)
Vcc: C19.1 C20.1 C21.1 C24.1 IC3.1(VIN) IC3.3(EN) R12.2 R13.2 U3.9(VOUT)
PG: R13.1 U3.5(PG)
NetC16_1: C16.1 C17.1 U3.2(VIN) U3.3(EN)
NetC18_1: C18.1 U3.6(VAUX)
NetC22_2: C22.2 R12.1 R14.2 U3.8(FB)
NetL1_1: L1.1 U3.1(L1)
NetL1_2: L1.2 U3.10(L2)

Not connected (* = marked no-connect by the designer): IC3 4(ADJ/NC)*; U3 4(PS/SYNC)*

### Notes on the sheet
- OPEN CONNECTION FOR ISOATE FROM SOURCE
- Title:
- Size:
- Document Number :
- Revision
- Drawn by:
- Checked by:
- Date:
- A4
- Time:
- Aprooved by:
- Sheet:
- of
- File:

### Library data of the parts
C16 C17 C23 C24 = CMP-2000-05448-2: as C1 on sheet MCU_watch; Device Class L1: Passive Components; ComponentLink2Description: Datasheet; Height: 0.95mm; Package: GRM18-0.15; Octopart: https://octopart.com/grm188r61a106ke69d-murata-22851381; Manufacturer Part Number: GRM188R61A106KE69D; Value: 10uF; Digikey Description: CAP CER 10UF 10V X5R 0603; Temperature Range High: +85°C; Temperature Range Low: -55°C; Temperature Characteristic: X5R; Capacitance: 10uF; RoHS: TRUE; Device Class L2: Capacitors; ComponentLink2URL: https://search.murata.co.jp/Ceramy/image/img/A01X/G101/ENG/GRM188R61A106KE69-01A.pdf; Device Class L3: Ceramic Capacitors; Lead Free: Yes; Mouser Description: Multilayer Ceramic Capacitors MLCC - SMD/SMT 0603 10uF 10volts X5R + - 10%; Category: Cap; Voltage Rating: 10V; Temperature: -55°C to +85°C; Automotive: No
C18 = CMP-13271-000587-1: as C3 on sheet MCU_watch; Case/Package: 0603; Depth: 0.8mm; Max Operating Temperature: 125°C; Lead Free: Lead Free; Material: Ceramic; Voltage Rating: 50V; Min Operating Temperature: -55°C; Voltage Rating (DC): 50V; Dielectric: X7R; Height: 0.8mm; Capacitance: 100nF; Thickness: 0.035inch; Radiation Hardening: No; Voltage: 50V; Packaging: Tape and Reel; Length: 1.6mm; Tolerance: 10%; Width: 0.031inch; Mount: Surface Mount; Package Quantity: 10000
C19-C21 = CMP-2000-06075-2: CAP CER 22UF 6.3V X5R 0603; Tolerance: 20%; Termination: SMD/SMT; Mount: Surface Mount; Depth: 0.8mm; Thickness: 0.035inch; Packaging: Tape and Reel; RoHS Compliant: Yes; Case/Package: 0603; Min Operating Temperature: -55°C; Package Quantity: 4000; Weight: 7.1E-05oz; Max Operating Temperature: 85°C; Voltage Rating (DC): 6.3V; Halogen Free: Halogen Free; Lead Free: Lead Free; Resistor Type: Ceramic; Case Code (Imperial): 0603; Width: 0.031inch; Case Code (Metric): 1608; Voltage Rating: 6.3V; Length: 0.063inch; Capacitance: 22uF; Dielectric: X5R
C22 = CMP-08246-005843-1: Multilayer Ceramic Capacitors 10pF ±0.5pF 50V C0G SMD 0603; Temperature Coefficient: 30ppm/°C; Tolerance: 5%; Termination: SMD/SMT; REACH SVHC: No SVHC; Package Quantity: 1; Case Code (Imperial): 0603; Number of Pins: 2; Capacitance: 10pF; Length: 1.6mm; Thickness: 0.037inch; Weight: 7.1E-05oz; Voltage Rating (DC): 50V; RoHS Compliant: Yes; Width: 0.031inch; Depth: 0.8mm; Case/Package: 0603; Dielectric Material: Ceramic; Voltage: 50V; Min Operating Temperature: -55°C; Case Code (Metric): 1608; Mount: Surface Mount; Height: 0.8mm; Construction: Flat; Series: C; Packaging: Tape and Reel; Radiation Hardening: No; Max Operating Temperature: 125°C; Lead Free: Lead Free; Voltage Rating: 50V; Dielectric: C0G
IC3 = AP2204K-3.3TRG1: Integrated Circuit; Manufacturer_Name: Diodes Incorporated; Datasheet Link: https://datasheet.datasheetarchive.com/originals/distributors/Datasheets_SAMA/5d52b656135dbfe7dbe35c76df69cd37.pdf; Height: 1.45mm; Manufacturer_Part_Number: AP2204K-3.3TRG1; Mouser Part Number: 621-AP2204K-3.3TRG1; Mouser Price/Stock: https://www.mouser.co.uk/ProductDetail/Diodes-Incorporated/AP2204K-3.3TRG1?qs=x6A8l6qLYDDMwVlYH0pN0g%3D%3D; Arrow Part Number: AP2204K-3.3TRG1; Arrow Price/Stock: https://www.arrow.com/en/products/ap2204k-3.3trg1/diodes-incorporated?region=nac
L1 = CMP-0007-00007-1: Semi-shielded Power Inductor, 1 uH, +/- 30%, 2.35 A, -40 to 125 degC, 3 x 3 x 1.5 mm SMD, RoHS and Halogen Free, Tape and Reel; Manufacturer: Bourns; Inductance tolerance: +/- 30%; DCR Max: 0.048 Ohm; Resistance to Solder Heat: +260 degC for 10 sec.; SRF Min: 145 MHz; Inductance: 1 uH; Isat: 2.35 A; ComponentLink3URL: http://www.bourns.com/data/global/pdfs/SRN3015.pdf; Packing: Tape and Reel; ComponentLink1Description: Manufacturer URL; DatasheetVersion: Aug-11; ComponentLink2URL: http://www.bourns.com/data/global/pdfs/SRN3015.pdf; PartNumber: SRN3015-1R0Y; ComponentLink3Description: Package Specification; RoHS: TRUE; Mounting Technology: Surface Mount; ComponentLink1URL: http://www.bourns.com/; Operating Temperature: -40 to 125 degC; Rated current: 2.35 A; PackageDescription: 2-Pin SMD, Body 3 x 3 mm, Height 1.5 mm; ComponentLink2Description: Datasheet; PackageReference: SRN3015
R12 R13 = CMP-1012-00849-3: RES SMD 1M OHM 1% 1/10W 0603; Resistance: 1MR; Voltage Rating: 75V; Temperature Coefficient: 100ppm/°C; Power Rating: 100mW; REACH SVHC: No SVHC; Radiation Hardening: No; Features: Automotive AEC-Q200; Case Code (Metric): 1608; Resistance Tolerance: 1%; Case/Package: 0603; Termination: SMD/SMT; Max Operating Temperature: 155°C; Tolerance: 1%; Size Code: 0603; Case Code (Imperial): 0603; Min Operating Temperature: -55°C; Number of Pins: 2; Mount: Surface Mount; Package Quantity: 1; Military Standard: Not; Voltage Rating (DC): 75V; Depth: 0.8mm; Packaging: Tape and Reel; Width: 0.8mm; Number of Terminations: 2; Length: 1.6mm; Height: 0.022inch; RoHS Compliant: Yes; Resistor Type: Thick Film; Contact Plating: Tin; Lead Free: Lead Free; Series: ERJ; Construction: Rectangular; Max Power Dissipation: 100mW
R14 = RN73H1JTTD1113D25: Resistor; Manufacturer_Name: KOA Speer; Datasheet Link: https://www.mouser.com/datasheet/2/219/RN73H-12200.pdf; Height: 0.55mm; Manufacturer_Part_Number: RN73H1JTTD1113D25; Mouser Part Number: 660-RN73H1JTD1113D25; Mouser Price/Stock: https://www.mouser.co.uk/ProductDetail/KOA-Speer/RN73H1JTTD1113D25?qs=0hon8nwgHrb8JI0BK8RpbQ%3D%3D
U3 = CMP-04918-000043-1: IC REG BCK BST ADJ 2A 10WSON; Manufacturer: Texas Instruments; Standoff Height: 0mm; Switching Frequency: 2400kHz; Min Supply Voltage: 2.5V; Number Of Outputs: 1; Output Voltage: 2.5-8V; Max Junction Temp: +125°C; Nominal Supply Current: 30uA; Output Type: AdjustableProgrammable; Output Current: 1A; Max Supply Voltage: 12V; Max Duty Cycle: 100%; Switching Topology: Buck-Boost; Octopart: https://octopart.com/tps63060dscr-texas+instruments-21396306; ComponentLink2Description: Datasheet; Category: IC; Ambient Temperature Range High: +85°C; Ipc Land Pattern Name: DFN300X300X70-10; Automotive: No; Manufacturer Part Number: TPS63060DSCR; Mouser Description: Voltage Regulators - Switching Regulators 2.5-12Vin,2.25A Sw Crnt Limit; Lead Free: Yes; Digikey Description: IC REG BCK BST ADJ 2A 10WSON; Device Class L3: Voltage Regulators - Switching; Ambient Temperature Range Low: -40°C; Temperature: -40°C to +85°C; Package: DSC0010G; Device Class L2: Power Management ICs; Device Class L1: Integrated Circuits (ICs); ComponentLink2URL: http://www.ti.com/lit/ds/symlink/tps63060.pdf; Temperature Range High: +85°C; Height: 0.8mm; RoHS: TRUE; Temperature Range Low: -40°C

## Sheet NRF.SchDoc: NRF Module
size A4; Author: Lasith Haputhanthri; SheetNumber: 8; SheetTotal: 9
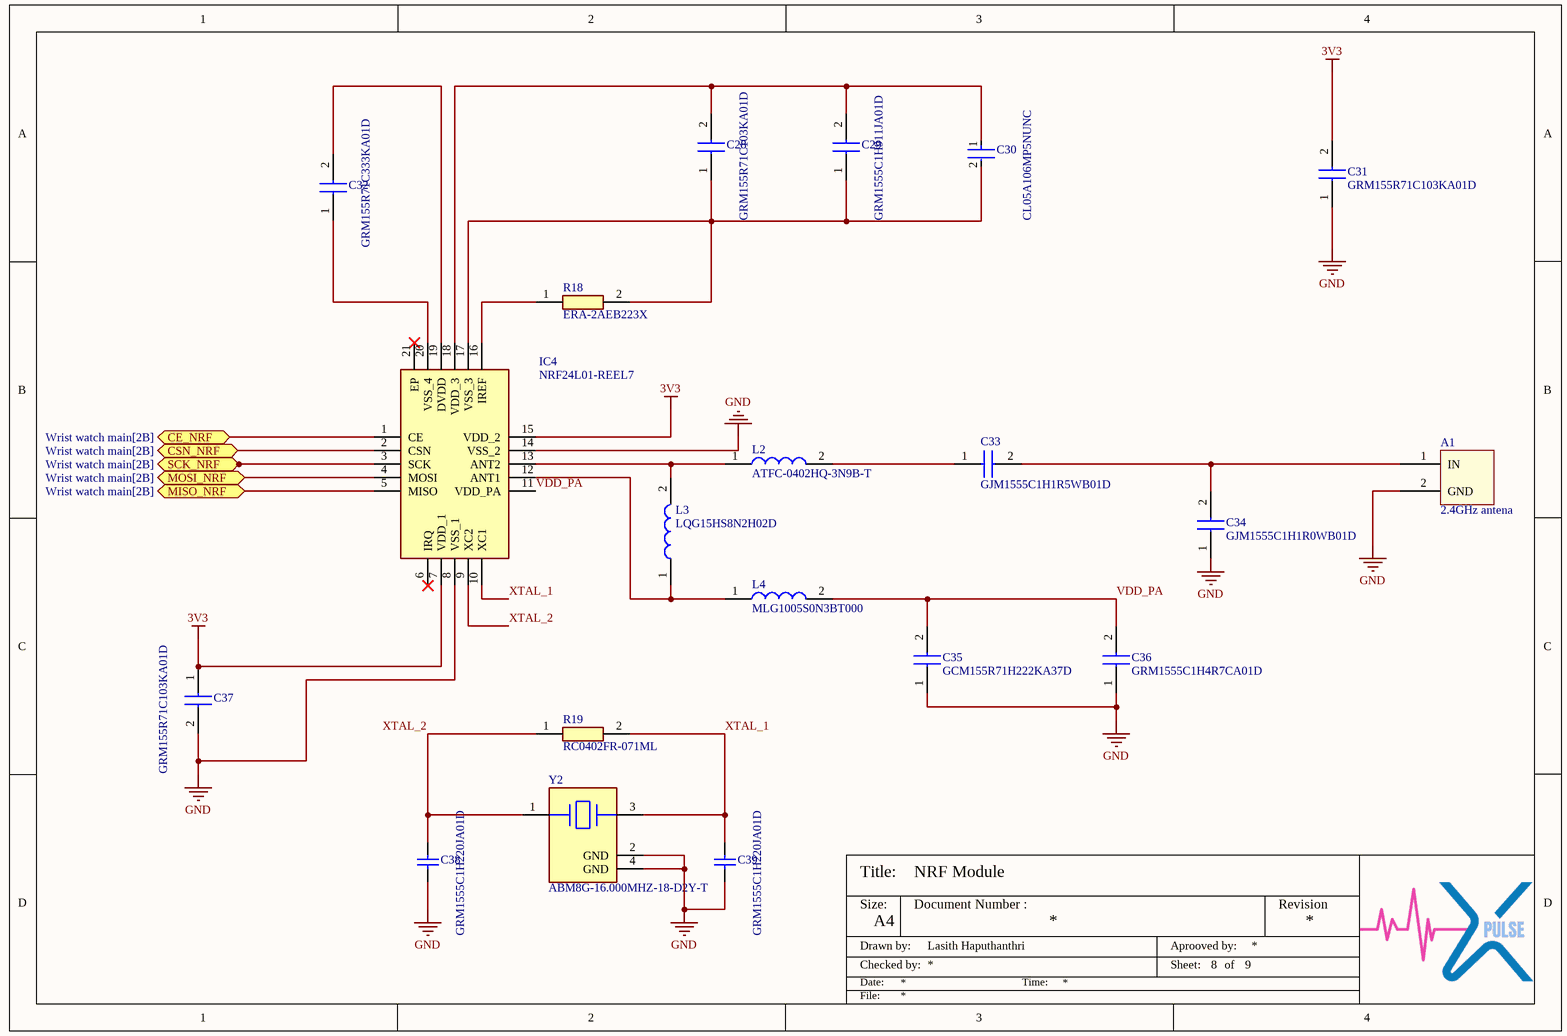
[diagram p7: NRF.SchDoc]

### Parts
A1  2.4GHz antena  [Antena]  (net tie, no BOM)
C28  GRM155R71C103KA01D  [CAPC1005X55N]
C29  GRM1555C1H911JA01D  [CAPC1005X55N]
C30  CL05A106MP5NUNC  [FP-CL05A106MP5NUNC-MFG]
C31  GRM155R71C103KA01D  [CAPC1005X55N]
C32  GRM155R71C333KA01D  [CAPC1005X55N]
C33  GJM1555C1H1R5WB01D  [CAPC1005X55N]
C34  GJM1555C1H1R0WB01D  [CAPC1005X55N]
C35  GCM155R71H222KA37D  [CAPC1005X55N]
C36  GRM1555C1H4R7CA01D  [CAPC1005X55N]
C37  GRM155R71C103KA01D  [CAPC1005X55N]
C38  GRM1555C1H220JA01D  [CAPC1005X55X25NL05T10]
C39  GRM1555C1H220JA01D  [CAPC1005X55X25NL05T10]
IC4  NRF24L01-REEL7  [QFN50P400X400X80-21N-D]
L2  ATFC-0402HQ-3N9B-T  [INDC1005X37N]
L3  LQG15HS8N2H02D  [LQG15WH0N7B02D]
L4  MLG1005S0N3BT000  [MLG1005]
R18  ERA-2AEB223X  [ERA2AED122X]
R19  RC0402FR-071ML  [RESC1005X40N]
Y2  ABM8G-16.000MHZ-18-D2Y-T  [FP-ABM8G-MFG]

### Ports
CE_NRF (bidir, see Wrist watch main[2B]), CSN_NRF (bidir, see Wrist watch main[2B]), MISO_NRF (bidir, see Wrist watch main[2B]), MOSI_NRF (bidir, see Wrist watch main[2B]), SCK_NRF (bidir, see Wrist watch main[2B])

### Nets
3V3: C31.2 C37.1 IC4.7(VDD_1) IC4.15(VDD_2)
GND: A1.2(GND) C31.1 C34.1 C35.1 C36.1 C37.2 C38.1 C39.1 IC4.8(VSS_1) IC4.14(VSS_2) Y2.2(GND) Y2.4(GND)
VDD_PA: C35.2 C36.2 IC4.11(VDD_PA) L4.2
XTAL_1: C39.2 IC4.10(XC1) R19.2 Y2.3
XTAL_2: C38.2 IC4.9(XC2) R19.1 Y2.1
NetA1_1: A1.1(IN) C33.2 C34.2
NetC28_1: C28.1 C29.1 C30.2 IC4.17(VSS_3) R18.2
NetC28_2: C28.2 C29.2 C30.1 IC4.18(VDD_3)
NetC32_1: C32.1 IC4.20(VSS_4)
NetC32_2: C32.2 IC4.19(DVDD)
NetC33_1: C33.1 L2.2
NetIC4_1: IC4.1(CE) ; port CE_NRF
NetIC4_2: IC4.2(CSN) ; port CSN_NRF
NetIC4_3: IC4.3(SCK) ; port SCK_NRF
NetIC4_4: IC4.4(MOSI) ; port MOSI_NRF
NetIC4_5: IC4.5(MISO) ; port MISO_NRF
NetIC4_12: IC4.12(ANT1) L3.1 L4.1
NetIC4_13: IC4.13(ANT2) L2.1 L3.2
NetIC4_16: IC4.16(IREF) R18.1

Not connected (* = marked no-connect by the designer): IC4 6(IRQ)* 21(EP)*

### Notes on the sheet
- Title:
- Size:
- Document Number :
- Revision
- Drawn by:
- Checked by:
- Date:
- A4
- Time:
- Aprooved by:
- Sheet:
- of
- File:

### Library data of the parts
C28 C31 C37 = GRM155R71C103KA01D: Capacitor; Manufacturer_Name: Murata Electronics; Datasheet Link: http://www.murata.com/~/media/webrenewal/support/library/catalog/products/capacitor/mlcc/c02e.pdf; Height: 0.55mm; Manufacturer_Part_Number: GRM155R71C103KA01D; Mouser Part Number: 81-GRM36X103K16; Mouser Price/Stock: https://www.mouser.co.uk/ProductDetail/Murata-Electronics/GRM155R71C103KA01D?qs=8YPuuxuUzMI%252B9QLnzeLwhQ%3D%3D; Arrow Part Number: GRM155R71C103KA01D; Arrow Price/Stock: https://www.arrow.com/en/products/grm155r71c103ka01d/murata-manufacturing?region=europe
C29 = GRM1555C1H911JA01D: Capacitor; Manufacturer_Name: Murata Electronics; Datasheet Link: http://www.murata.com/~/media/webrenewal/support/library/catalog/products/capacitor/mlcc/c02e.pdf; Height: 0.55mm; Manufacturer_Part_Number: GRM1555C1H911JA01D; Mouser Part Number: 81-GRM1555C1H911JA1D; Mouser Price/Stock: https://www.mouser.co.uk/ProductDetail/Murata-Electronics/GRM1555C1H911JA01D?qs=p6VZ%252BklCkRTpKNdGAzqH7g%3D%3D
C30 = CMP-13271-000002-1: CAP CER 10UF 10V X5R 0402; Manufacturer: Samsung; Temperature Coefficient: 15%; Tolerance: 20%; Material: Ceramic; Octopart: https://octopart.com/cl05a106mp5nunc-samsung-22457395; Voltage Rating: 10V; RoHS: TRUE; Value: 10uF; Height: 0.7mm; Digikey Description: CAP CER 10UF 10V X5R 0402; Automotive: No; Package: CL05A106MP5NUNC; Device Class L1: Passive Components; Capacitance: 10uF; Temperature Range High: +85°C; ComponentLink2Description: Datasheet; Device Class L2: Capacitors; Temperature Characteristic: X5R; Manufacturer Part Number: CL05A106MP5NUNC; Temperature: -55°C to +85°C; ComponentLink2URL: http://www.samsungsem.com/kr/support/product-search/mlcc/__icsFiles/afieldfile/2019/05/10/19-CL05A106MP5NUNC.pdf; Device Class L3: Ceramic Capacitors; Category: Cap; Temperature Range Low: -55°C; Ipc Land Pattern Name: CAPC10050X50; Lead Free: Yes
C32 = GRM155R71C333KA01D: Capacitor; Manufacturer_Name: Murata Electronics; Datasheet Link: http://www.murata.com/~/media/webrenewal/support/library/catalog/products/capacitor/mlcc/c02e.pdf; Height: 0.55mm; Manufacturer_Part_Number: GRM155R71C333KA01D; Arrow Part Number: GRM155R71C333KA01D; Arrow Price/Stock: https://www.arrow.com/en/products/grm155r71c333ka01d/murata-manufacturing
C33 = GJM1555C1H1R5WB01D: Capacitor; Manufacturer_Name: Murata Electronics; Datasheet Link: https://psearch.en.murata.com/capacitor/product/GJM1555C1H1R5WB01%23.html; Height: 0.55mm; Manufacturer_Part_Number: GJM1555C1H1R5WB01D; Mouser Part Number: 81-GJM1555C1H1R5WB1D; Mouser Price/Stock: https://www.mouser.co.uk/ProductDetail/Murata-Electronics/GJM1555C1H1R5WB01D?qs=YLLXL5qGyDucsRPozQcunA%3D%3D; Arrow Part Number: GJM1555C1H1R5WB01D; Arrow Price/Stock: https://www.arrow.com/en/products/gjm1555c1h1r5wb01d/murata-manufacturing?region=nac
C34 = GJM1555C1H1R0WB01D: Capacitor; Manufacturer_Name: Murata Electronics; Datasheet Link: https://psearch.en.murata.com/capacitor/product/GJM1555C1H1R0WB01%23.html; Height: 0.55mm; Manufacturer_Part_Number: GJM1555C1H1R0WB01D; Mouser Part Number: 81-GJM1555C1H1R0WB1D; Mouser Price/Stock: https://www.mouser.co.uk/ProductDetail/Murata-Electronics/GJM1555C1H1R0WB01D?qs=YLLXL5qGyDtaruZHJwTPNg%3D%3D; Arrow Part Number: GJM1555C1H1R0WB01D; Arrow Price/Stock: https://www.arrow.com/en/products/gjm1555c1h1r0wb01d/murata-manufacturing?region=nac
C35 = GCM155R71H222KA37D: Capacitor; Manufacturer_Name: Murata Electronics; Datasheet Link: https://psearch.en.murata.com/capacitor/product/GCM155R71H222KA37%23.html; Height: 0.55mm; Manufacturer_Part_Number: GCM155R71H222KA37D; Mouser Part Number: 81-GCM155R71H222K37D; Mouser Price/Stock: https://www.mouser.co.uk/ProductDetail/Murata-Electronics/GCM155R71H222KA37D?qs=QDXoN8f0aYKEsLYYwicpIw%3D%3D; Arrow Part Number: GCM155R71H222KA37D; Arrow Price/Stock: https://www.arrow.com/en/products/gcm155r71h222ka37d/murata-manufacturing?region=nac
C36 = GRM1555C1H4R7CA01D: Capacitor; Manufacturer_Name: Murata Electronics; Datasheet Link: http://www.murata.com/~/media/webrenewal/support/library/catalog/products/capacitor/mlcc/c02e.pdf; Height: 0.55mm; Manufacturer_Part_Number: GRM1555C1H4R7CA01D; Mouser Part Number: 81-GRM1555C1H4R7CA1D; Mouser Price/Stock: https://www.mouser.co.uk/ProductDetail/Murata-Electronics/GRM1555C1H4R7CA01D?qs=4k9rjS6ZRl7tSQRzstyMVg%3D%3D; Arrow Part Number: GRM1555C1H4R7CA01D; Arrow Price/Stock: https://www.arrow.com/en/products/grm1555c1h4r7ca01d/murata-manufacturing
C38 C39 = CMP-2008-04302-1: Manufacturer: Murata; Part Number: GRM1555C1H220JA01D
IC4 = NRF24L01-REEL7: Integrated Circuit; Manufacturer_Name: Nordic Semiconductor; Datasheet Link: https://4donline.ihs.com/images/VipMasterIC/IC/NRSA/NRSAS00020/NRSAS00020-1.pdf?hkey=EF798316E3902B6ED9A73243A3159BB0; Height: 0.8mm; Manufacturer_Part_Number: NRF24L01-REEL7; Mouser Part Number: 949-NRF24L01-REEL7; Mouser Price/Stock: https://www.mouser.co.uk/ProductDetail/Nordic-Semiconductor/nRF24L01-REEL7?qs=yd0qOhnSiDfNM3Q865kckA%3D%3D; Arrow Part Number: NRF24L01-REEL7; Arrow Price/Stock: null?region=nac
L2 = ATFC-0402HQ-3N9B-T: Inductor; Manufacturer_Name: ABRACON; Datasheet Link: https://abracon.com/Magnetics/inductors/ATFC-0402HQ.pdf; Height: 0.37mm; Manufacturer_Part_Number: ATFC-0402HQ-3N9B-T
L3 = LQG15HS8N2H02D: Inductor; Manufacturer_Name: Murata Electronics; Datasheet Link: https://psearch.en.murata.com/inductor/product/LQG15HS8N2H02%23.html; Height: 0.55mm; Manufacturer_Part_Number: LQG15HS8N2H02D; Mouser Part Number: 81-LQG15HS8N2H02D; Mouser Price/Stock: https://www.mouser.co.uk/ProductDetail/Murata-Electronics/LQG15HS8N2H02D?qs=60uY6ySkanTiptaknJqb2Q%3D%3D; Arrow Part Number: LQG15HS8N2H02D; Arrow Price/Stock: https://www.arrow.com/en/products/lqg15hs8n2h02d/murata-manufacturing
L4 = MLG1005S0N3BT000: Inductor; Manufacturer_Name: TDK; Datasheet Link: https://product.tdk.com/system/files/dam/doc/product/inductor/inductor/smd/catalog/inductor_commercial_high-frequency_mlg1005s_en.pdf; Manufacturer_Part_Number: MLG1005S0N3BT000; Mouser Part Number: 810-MLG1005S0N3BT000; Mouser Price/Stock: https://www.mouser.co.uk/ProductDetail/TDK/MLG1005S0N3BT000?qs=u4%252BEJ9urDASg1T%252BCePJhFw%3D%3D; Arrow Part Number: MLG1005S0N3BT000; Arrow Price/Stock: https://www.arrow.com/en/products/mlg1005s0n3bt000/tdk
R18 = ERA-2AEB223X: Resistor; Manufacturer_Name: Panasonic; Datasheet Link: http://industrial.panasonic.com/cdbs/www-data/pdf/RDM0000/AOA0000C307.pdf; Height: 0.4mm; Manufacturer_Part_Number: ERA-2AEB223X; Mouser Part Number: 667-ERA-2AEB223X; Mouser Price/Stock: https://www.mouser.co.uk/ProductDetail/Panasonic/ERA-2AEB223X?qs=YFwoyZoVY0gOqA4AmOyJ2g%3D%3D; Arrow Part Number: ERA-2AEB223X; Arrow Price/Stock: https://www.arrow.com/en/products/era2aeb223x/panasonic?region=europe
R19 = RC0402FR-071ML: Resistor; Manufacturer_Name: KEMET; Datasheet Link: http://www.yageo.com/documents/recent/PYu-RC0402_51_RoHS_L_6_r.pdf; Height: 0.4mm; Manufacturer_Part_Number: RC0402FR-071ML; Mouser Part Number: 603-RC0402FR-071ML; Mouser Price/Stock: https://www.mouser.co.uk/ProductDetail/YAGEO/RC0402FR-071ML?qs=V1yeUXFNrknfoI4987wfBQ%3D%3D
Y2 = CMP-2000-05039-3: Crystal 12MHz ±20ppm (Tol) ±30ppm (Stability) 18pF FUND 120Ω 4-Pin SMD T/R; Series Resistance: 120R; Max Operating Temperature: 85°C; Mount: Surface Mount; Width: 2.5mm; Series: ABM8G; Termination: SMD/SMT; Frequency Tolerance: 20ppm; Tolerance: 20ppm; Min Operating Temperature: -40°C; Operating Frequency: 12 MHz; Depth: 2.5mm; Load Capacitance: 18pF; Number of Pins: 4; Length: 3.2mm; Radiation Hardening: No; Frequency Stability: 30ppm; Height: 1mm; Packaging: Tape and Reel; Package Quantity: 1000; ESR (Equivalent Series Resistance): 120R; Lead Free: Lead Free; Frequency: 12MHz; Case/Package: CSMD

## Sheet SerialCom.SchDoc
size A4; SheetNumber: 9; SheetTotal: 9
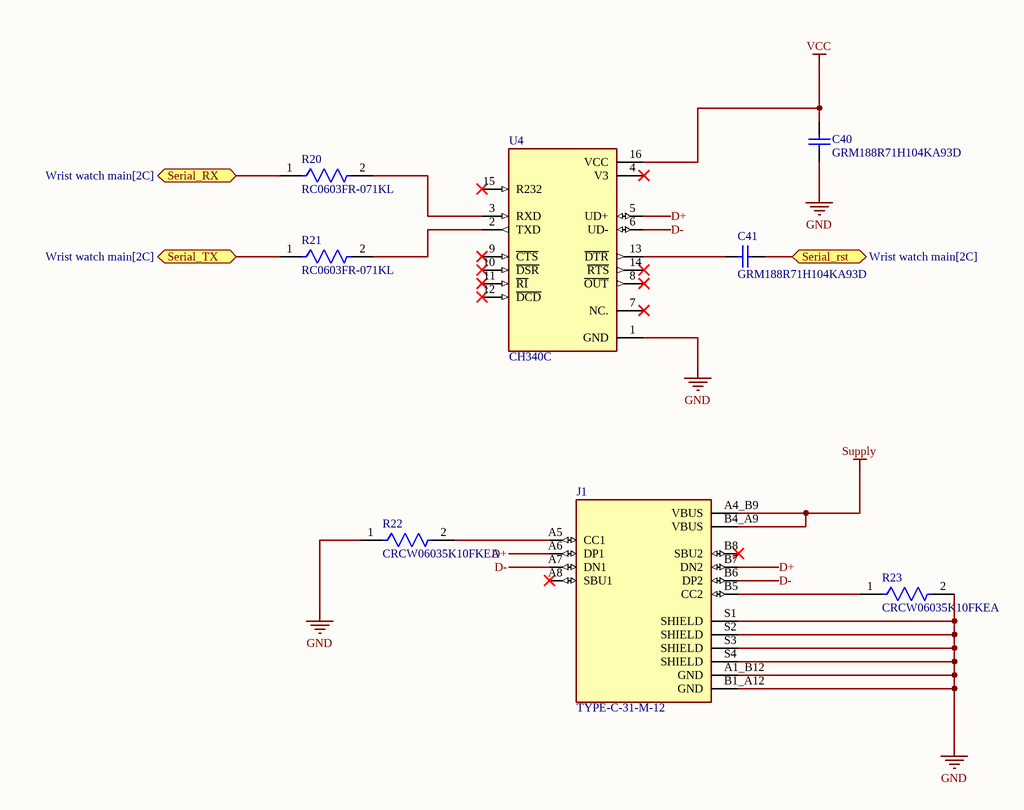
[diagram p8: SerialCom.SchDoc]

### Parts
C40  GRM188R71H104KA93D  [CAPC1608X90X35ML10T15]
C41  GRM188R71H104KA93D  [CAPC1608X90X35ML10T15]
J1  TYPE-C-31-M-12  [HRO_TYPE-C-31-M-12]
R20  RC0603FR-071KL  [FP-RC0603-0_55-IPC_C]
R21  RC0603FR-071KL  [FP-RC0603-0_55-IPC_C]
R22  CRCW06035K10FKEA  [FP-CRCW0603-e3-IPC_C]
R23  CRCW06035K10FKEA  [FP-CRCW0603-e3-IPC_C]
U4  CH340C  [SOIC127P600X180-16N]

### Ports
Serial_rst (bidir, see Wrist watch main[2C]), Serial_RX (bidir, see Wrist watch main[2C]), Serial_TX (bidir, see Wrist watch main[2C])

### Nets
GND: C40.1 J1.A1_B12(GND) J1.B1_A12(GND) J1.S1(SHIELD) J1.S2(SHIELD) J1.S3(SHIELD) J1.S4(SHIELD) R22.1 R23.2 U4.1(GND)
Supply: J1.A4_B9(VBUS) J1.B4_A9(VBUS)
Vcc: C40.2 U4.16(VCC)
D+: J1.A6(DP1) J1.B7(DN2) U4.5(UD+)
D-: J1.A7(DN1) J1.B6(DP2) U4.6(UD-)
RST: C41.2 ; port Serial_rst
NetC41_1: C41.1 U4.13(~{DTR})
NetJ1_A5: J1.A5(CC1) R22.2
NetJ1_B5: J1.B5(CC2) R23.1
NetR20_1: R20.1 ; port Serial_RX
NetR20_2: R20.2 U4.3(RXD)
NetR21_1: R21.1 ; port Serial_TX
NetR21_2: R21.2 U4.2(TXD)

Not connected (* = marked no-connect by the designer): J1 A8(SBU1)* B8(SBU2)*; U4 4(V3)* 7(NC.)* 8(~{OUT})* 9(~{CTS})* 10(~{DSR})* 11(~{RI})* 12(~{DCD})* 14(~{RTS})* 15(R232)*

### Notes on the sheet
- Title:
- Size:
- Document Number :
- Revision
- Drawn by:
- Checked by:
- Date:
- A4
- Time:
- Aprooved by:
- Sheet:
- of
- File:

### Library data of the parts
C40 C41 = CMP-2100-03643-1: Chip Capacitor, 0.1 uF, +/- 10%, 50 V, -55 to 125 degC, 0603 (1608 Metric), RoHS, Tape and Reel; Manufacturer: Murata; Dielectric Material: Ceramic; Voltage Rating: 50V; Capacitance: 100nF; Dielectric: X7R; Insulation Resistance: 10GR; Case Code (Metric): 1608; Lead Free: LeadFree; Depth: 0.8mm; Number of Pins: 2; Radiation Hardening: No; Case/Package: 0603; Manufacturer URL: http://www.murata.com/; Packaging: TapeandReel; Length: 1.6mm; Contact Plating: Tin; Datasheet URL: http://psearch.en.murata.com/capacitor/product/GRM188R71H104KA93%23.pdf; Tolerance: 10%; Case Code (Imperial): 0603; Min Operating Temperature: -55degC; RoHSCompliant: true; Voltage: 50V; Termination: SMD/SMT; Mount: SurfaceMount; Material: Ceramic; Package Quantity: 1; Height: 0.8mm; Thickness: 0.035inch; REACH SVHC: NoSVHC; Max Operating Temperature: 125degC; Width: 0.8mm; Package Reference: 0603; Voltage Rating (DC): 50V; Datasheet Version: 42675.0; Package Description: 2-Pin Surface Mount Device, Body 1.6 x 0.8 mm
J1 = TYPE-C-31-M-12: USB Connectors 24 Receptacle 1 8.94*7.3mm RoHS; MF: HRO Electronics Co., Ltd.; Price: None; Value: *; SnapEDA_Link: https://www.snapeda.com/parts/TYPE-C-31-M-12/HRO+Electronics+Co.%252C+Ltd./view-part/?ref=snap; Package: Package; Availability: Not in stock; Check_prices: https://www.snapeda.com/parts/TYPE-C-31-M-12/HRO+Electronics+Co.%252C+Ltd./view-part/?ref=eda; MP: TYPE-C-31-M-12
R20 R21 = CMP-1659-00009-5: RES 1K OHM 1% 1/10W 0603; Resistance: 1kR; Voltage Rating: 50V; Power Rating: 100mW; Temperature Coefficient: 100ppm/°C; Military Standard: Not; REACH SVHC: No SVHC; Size Code: 0603; Features: Moisture Resistant; Number of Terminations: 2; Technology: THICK FILM; Series: RC; Case Code (Metric): 1608; Resistance Tolerance: 1%; Resistor Type: Thick Film; Termination: SMD/SMT; Contact Plating: Tin; Radiation Hardening: No; Min Operating Temperature: -55°C; Max Operating Temperature: 155°C; Packaging: Tape and Reel; Max Power Dissipation: 100mW; RoHS Compliant: Yes; Height: 0.45mm; Lead Free: Lead Free; Case/Package: 0603; Length: 1.6mm; Tolerance: 1%; Case Code (Imperial): 0603; Construction: Rectangular; Depth: 0.8mm
R22 R23 = CMP-1012-00590-3: RES Thick Film, 5.1kΩ, 1%, 0.1W, 100ppm/°C, 0603; Power Rating: 100mW; Voltage Rating (DC): 75V; Resistance: 5.1kR; Width: 0.85mm; Depth: 0.85mm; Military Standard: Not; Package Quantity: 5000; Case Code (Metric): 1608; Length: 1.55mm; Weight: 7.1E-05oz; Packaging: Tape and Reel; Temperature Coefficient: 100ppm/°C; Case Code (Imperial): 0603; Lead Free: Lead Free; Radiation Hardening: No; Contact Plating: Tin; Composition: Thick Film; Max Operating Temperature: 155°C; Termination: SMD/SMT; Case/Package: 0603; Min Operating Temperature: -55°C; Tolerance: 1%; Voltage Rating: 75V; Mount: Surface Mount; Height: 0.45mm
U4 = CH340C: USB to serial chip CH340; MF: WCH; Price: None; Availability: Not in stock; MP: CH340C; Package: None; SnapEDA_Link: https://www.snapeda.com/parts/CH340C/WCH/view-part/?ref=snap; Check_prices: https://www.snapeda.com/parts/CH340C/WCH/view-part/?ref=eda; Value: *

## Nets that join several sheets
3V3: plsoxmeter (C12.1 IC2.9 IC2.10), Power (C23.1 IC3.5), NRF (C31.2 C37.1 IC4.7 IC4.15)
Battery: Lipo_Charger (C13.1 R5.2 R6.2 U2.10), Vibrator (C15.1 D1.1)
GND: MCU_watch (14 pins), plsoxmeter (8 pins), Lipo_Charger (8 pins), Vibrator (Q1.2 R11.1), Buttons (C25.2 C26.2 C27.2), Power (13 pins), NRF (12 pins), SerialCom (10 pins)
Supply: Lipo_Charger (C14.1 U2.1), SerialCom (J1.A4_B9 J1.B4_A9)
Vcc: MCU_watch (7 pins), plsoxmeter (C8.1 C9.1 IC1.1 IC1.3), Buttons (R15.2 R16.2 R17.2), Power (9 pins), SerialCom (C40.2 U4.16)
NetIC2_2: MCU_watch (U1.28), plsoxmeter (IC2.2 R4.1)
NetIC2_3: MCU_watch (U1.27), plsoxmeter (IC2.3 R2.1)
NetIC4_1: MCU_watch (U1.12), NRF (IC4.1)
NetIC4_2: MCU_watch (U1.11), NRF (IC4.2)
NetIC4_3: MCU_watch (U1.17), NRF (IC4.3)
NetIC4_4: MCU_watch (U1.15), NRF (IC4.4)
NetIC4_5: MCU_watch (U1.16), NRF (IC4.5)
NetR10_1: MCU_watch (U1.9), Vibrator (R10.1)
NetR20_1: MCU_watch (U1.31), SerialCom (R20.1)
NetR21_1: MCU_watch (U1.30), SerialCom (R21.1)
RST: MCU_watch (5 pins), SerialCom (C41.2)
SW1: MCU_watch (U1.1), Buttons (C25.1 R15.1)
SW2: MCU_watch (U1.32), Buttons (C27.1 R17.1)
SW3: MCU_watch (U1.2), Buttons (C26.1 R16.1)